# EasyEDA schematic LM317-Adjustable-Power-Supply-EasyEDA.json
TITLE: Sheet_1; REV: 1.0; Date: 2025-08-01; Sheet: 1/1; Drawn By: 2420040055; Company: Your Company
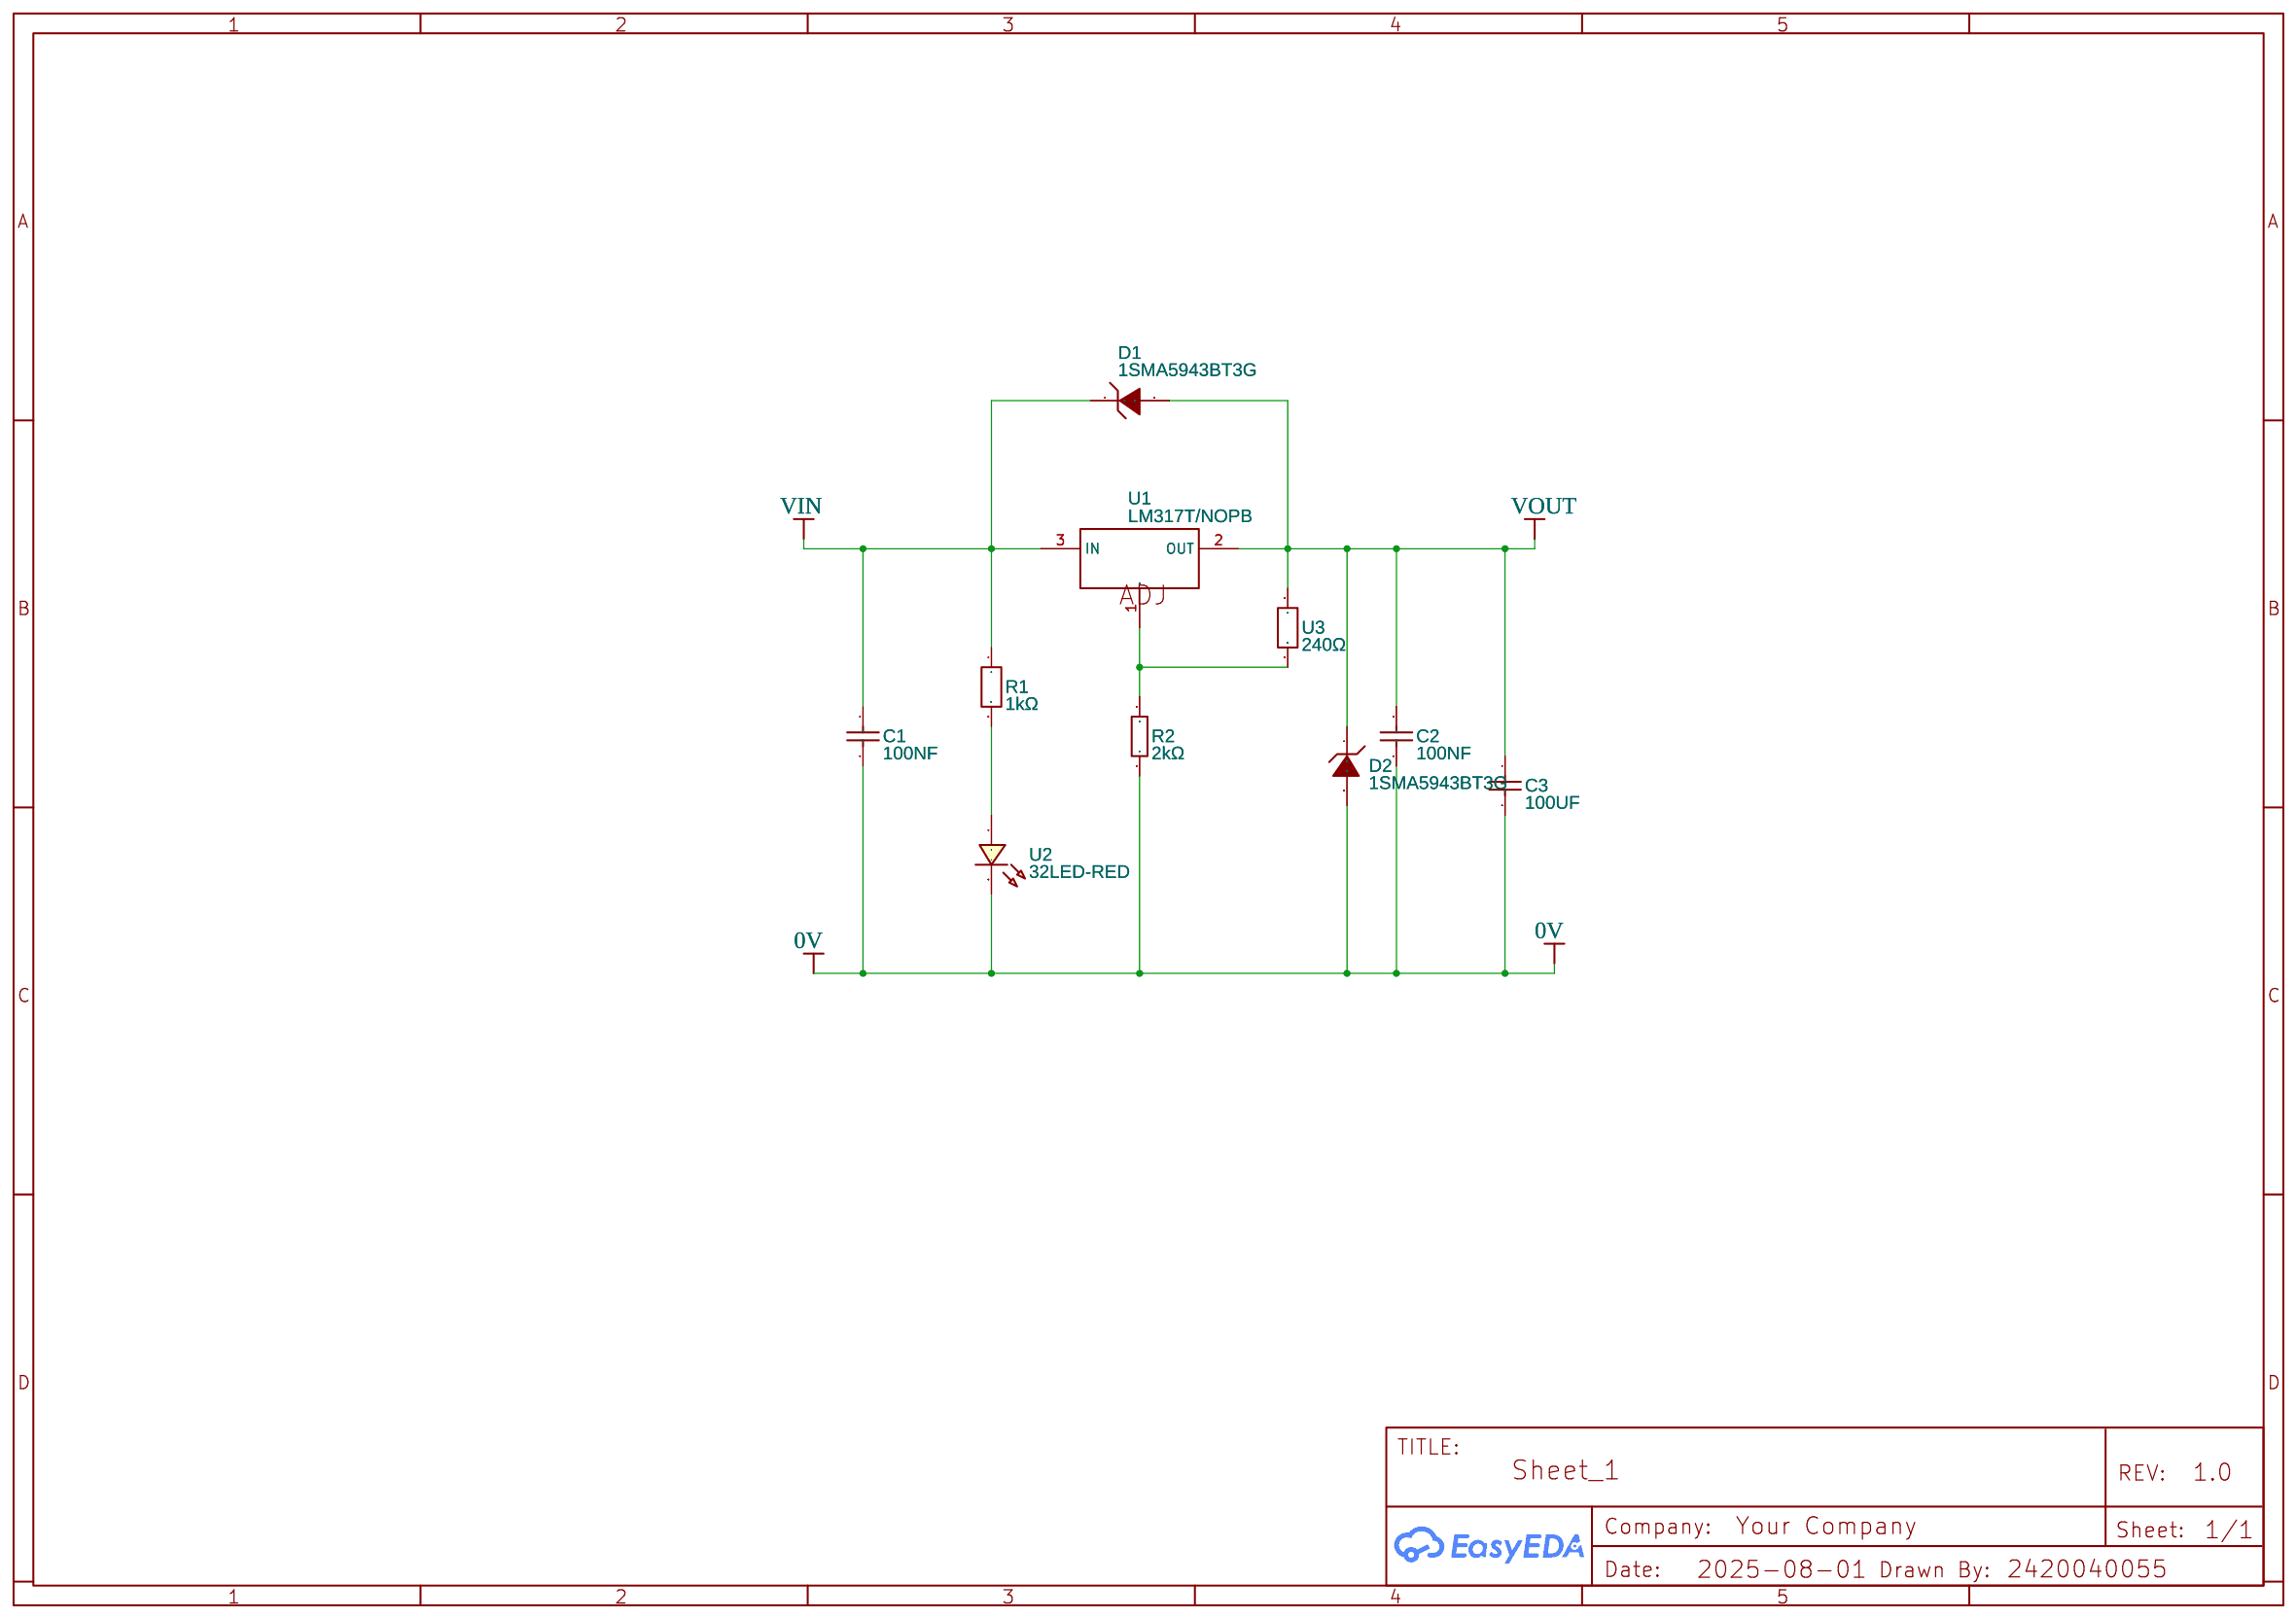
[diagram p0: schematic sheet]

## Parts
C1  100NF  [CAP-TH_L6.5-W4.0-P5.00-D1.0]
C2  100NF  [CAP-TH_L6.5-W4.0-P5.00-D1.0]
C3  100UF  [CAP-TH_L6.5-W4.0-P5.00-D1.0]
D1  1SMA5943BT3G  [SMA_L4.4-W2.8-LS5.4-RD]
D2  1SMA5943BT3G  [SMA_L4.4-W2.8-LS5.4-RD]
R1  1kΩ  [RES-SMD_L28.6-W12.0_OHMITE_RWS10]
R2  2kΩ  [RES-TH_BD5.0-L15.5-P19.50-D0.8]
U1  LM317T/NOPB  [TO-220-3_L10.2-W4.6-P2.54-L]
U2  32LED-RED  [LED-TH_L5..8-W5.6-P2.54_32LED-RED]
U3  240Ω  [RES-TH_BD8.7-L46.0-P50.00-D1.0]

## Library data of the parts
C1-C3 = CAPACITOR15NF100V: Contributor: LCSC; Supplier: LCSC; Manufacturer: null; Manufacturer Part: 电容15nf100v; Supplier Part: C26191; JLCPCB Part Class: Extended Part
D1 D2 = 1SMA5943BT3G: Contributor: LCSC; Supplier: LCSC; Supplier Part: C238876; Manufacturer: onsemi(安森美); JLCPCB Part Class: Extended Part
R1 = RWS10 1K J TR: Supplier: LCSC; Supplier Part: C6995824; Manufacturer: Ohmite; Contributor: lcsc
R2 = MFR200FRF52-2K: Contributor: lcsc; Supplier: LCSC; Supplier Part: C1763164; Manufacturer: YAGEO(国巨); JLCPCB Part Class: Extended Part
U1 = LM317T/NOPB: Contributor: LCSC; Supplier: LCSC; Supplier Part: C2870516; Manufacturer: TI(德州仪器); JLCPCB Part Class: Extended Part
U2 = 32LED-RED: Supplier: LCSC; Supplier Part: C3306983; Manufacturer: Grayhill; JLCPCB Part Class: Extended Part; Contributor: lcsc
U3 = 90J240E: Contributor: lcsc; Supplier: LCSC; Supplier Part: C3437163; Manufacturer: Ohmite; JLCPCB Part Class: Extended Part

## Nets
0V: C1.2 C2.2 C3.2 D2.2(A) R2.2 U2.2(-)
VIN: C1.1 D1.1(C) R1.1 U1.3(IN)
VOUT: C2.1 C3.1 D1.2(A) D2.1(C) U1.2(OUT) U3.1
Net-(R1-2): R1.2 U2.1(+)
Net-(R2-1): R2.1 U1.1(ADJ) U3.2
